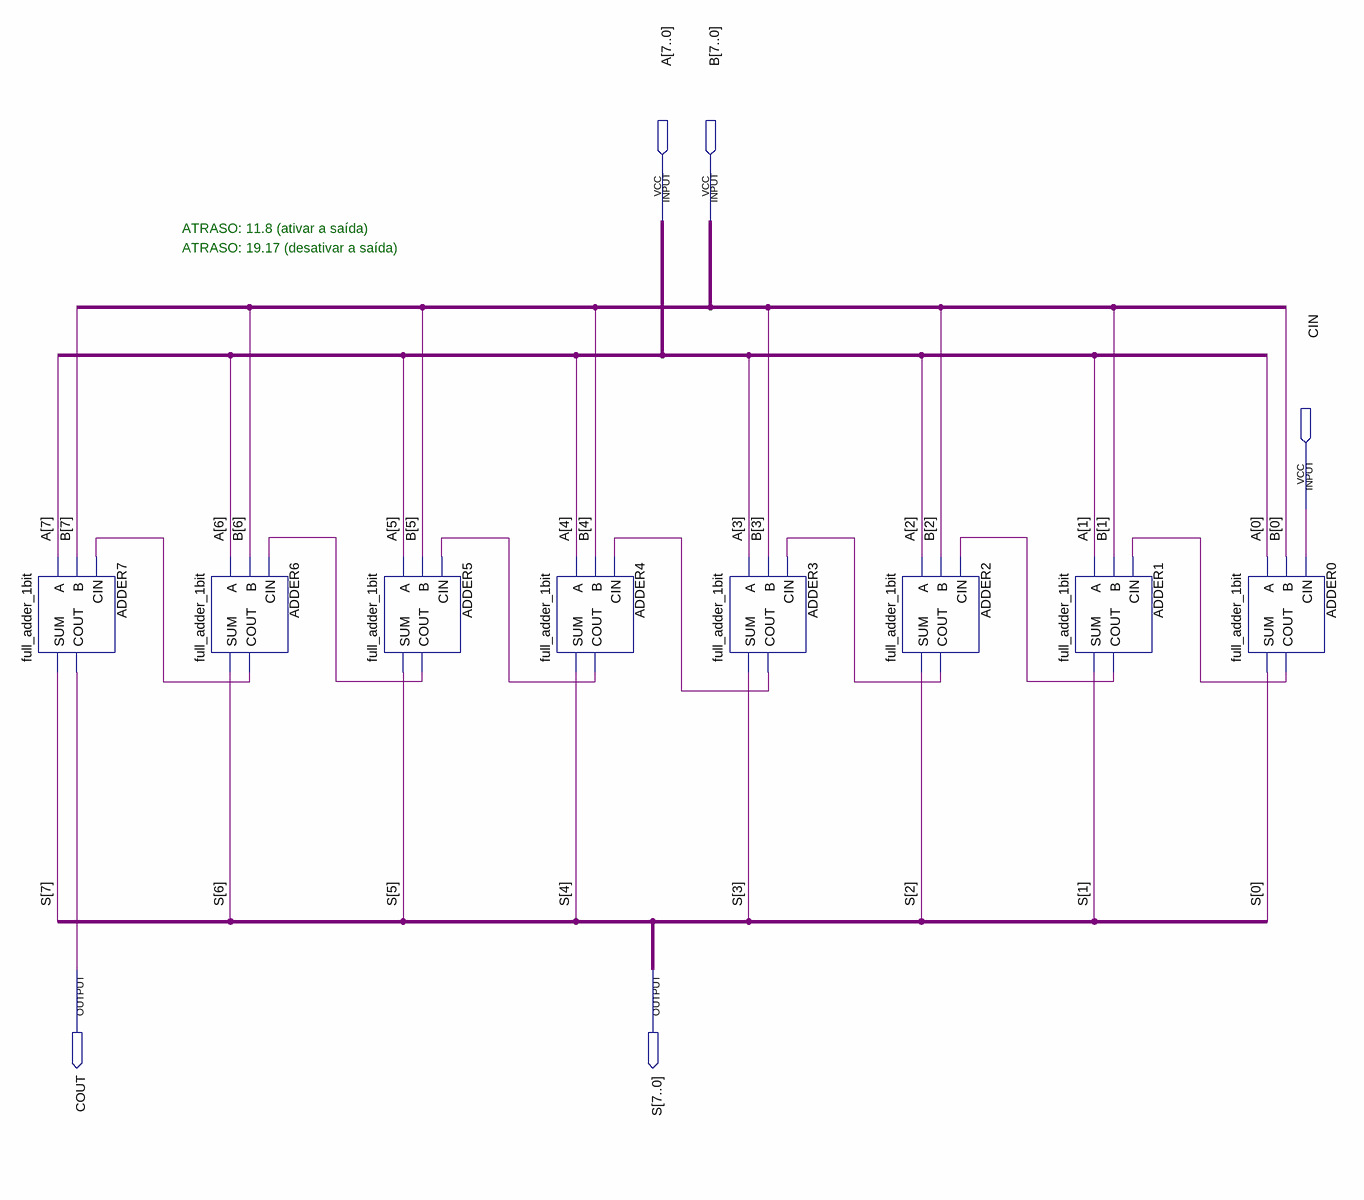
[diagram p0: schematic sheet]
// Quartus schematic full_adder_8bit.bdf as structural Verilog: 8 symbols, 5 pins
module full_adder_8bit (
  input  [7:0] A,
  input  [7:0] B,
  input  CIN,
  output COUT,
  output [7:0] S
);

  wire ADDER0_cout, ADDER1_cout, ADDER2_cout, ADDER3_cout, ADDER4_cout, ADDER5_cout, ADDER6_cout;

  full_adder_1bit ADDER7 (.A(A[7]), .B(B[7]), .CIN(ADDER6_cout), .SUM(S[7]), .COUT(COUT));
  full_adder_1bit ADDER6 (.A(A[6]), .B(B[6]), .CIN(ADDER5_cout), .SUM(S[6]), .COUT(ADDER6_cout));
  full_adder_1bit ADDER5 (.A(A[5]), .B(B[5]), .CIN(ADDER4_cout), .SUM(S[5]), .COUT(ADDER5_cout));
  full_adder_1bit ADDER4 (.A(A[4]), .B(B[4]), .CIN(ADDER3_cout), .SUM(S[4]), .COUT(ADDER4_cout));
  full_adder_1bit ADDER3 (.A(A[3]), .B(B[3]), .CIN(ADDER2_cout), .SUM(S[3]), .COUT(ADDER3_cout));
  full_adder_1bit ADDER2 (.A(A[2]), .B(B[2]), .CIN(ADDER1_cout), .SUM(S[2]), .COUT(ADDER2_cout));
  full_adder_1bit ADDER1 (.A(A[1]), .B(B[1]), .CIN(ADDER0_cout), .SUM(S[1]), .COUT(ADDER1_cout));
  full_adder_1bit ADDER0 (.A(A[0]), .B(B[0]), .CIN(CIN), .SUM(S[0]), .COUT(ADDER0_cout));

  // Notes on the sheet:
  //   ATRASO: 11.8 (ativar a saída)
  //   ATRASO: 19.17 (desativar a saída)
endmodule
